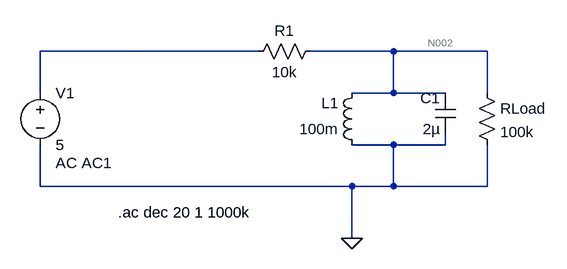
[diagram p0: schematic schemat.asc]
schemat.asc, the LTspice schematic file:
Version 4
SHEET 1 880 680
WIRE 192 -16 -144 -16
WIRE 400 -16 272 -16
WIRE 544 -16 400 -16
WIRE -144 48 -144 -16
WIRE 400 48 400 -16
WIRE 400 48 336 48
WIRE 480 48 400 48
WIRE 544 48 544 -16
WIRE 400 128 336 128
WIRE 480 128 480 112
WIRE 480 128 400 128
WIRE -144 192 -144 128
WIRE 336 192 -144 192
WIRE 400 192 400 128
WIRE 400 192 336 192
WIRE 544 192 544 128
WIRE 544 192 400 192
WIRE 336 272 336 192
WIRE 0 0 0 0
FLAG 336 272 0
SYMBOL voltage -144 32 R0
WINDOW 123 24 124 Left 2
WINDOW 39 0 0 Left 0
SYMATTR Value2 AC AC1
SYMATTR InstName V1
SYMATTR Value 5
SYMBOL cap 496 112 R180
WINDOW 0 24 56 Left 2
WINDOW 3 24 8 Left 2
SYMATTR InstName C1
SYMATTR Value 2µ
SYMBOL res 176 0 R270
WINDOW 0 32 56 VTop 2
WINDOW 3 0 56 VBottom 2
SYMATTR InstName R1
SYMATTR Value 10k
SYMBOL res 528 32 R0
SYMATTR InstName RLoad
SYMATTR Value 100k
SYMBOL ind 352 144 R180
WINDOW 0 36 80 Left 2
WINDOW 3 36 40 Left 2
SYMATTR InstName L1
SYMATTR Value 100m
TEXT -24 232 Left 2 !.ac dec 20 1 1000k

The netlist it stands for:
* schemat.asc
V1 N001 0 5 AC AC1
C1 0 N002 2µ
R1 N001 N002 10k
RLoad N002 0 100k
L1 0 N002 100m
.ac dec 20 1 1000k
.backanno
.end

* Results of the author's LTspice run, read from the files saved beside the schematic
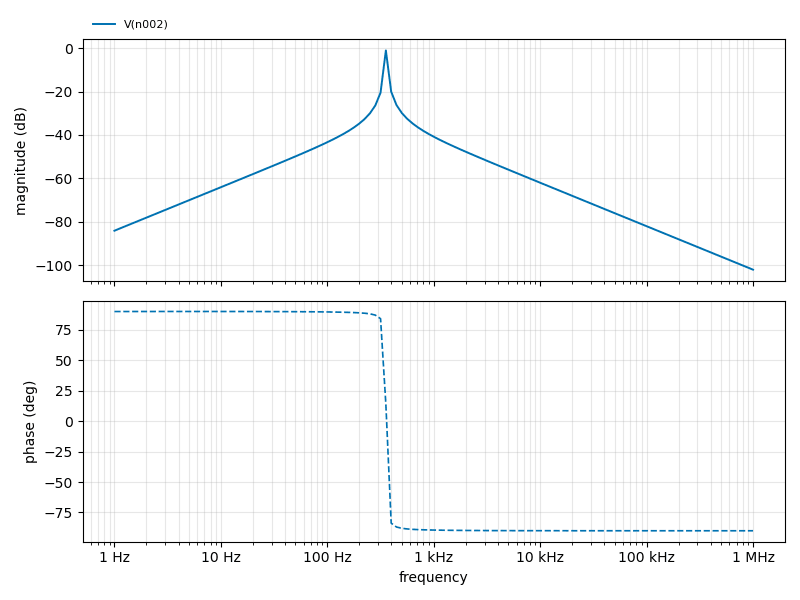
[diagram p1: AC Analysis of schemat.asc, plotted from the saved traces]
* AC Analysis, 1 run:
*   V(n002): -84.04 dB at 1 Hz, -101.98 dB at 1 MHz, peak -1.08 dB at 354.8 Hz, 3 dB below the peak at 348.6 Hz and 361.3 Hz